# Altium schematic sheet CAN.SchDoc
size A4
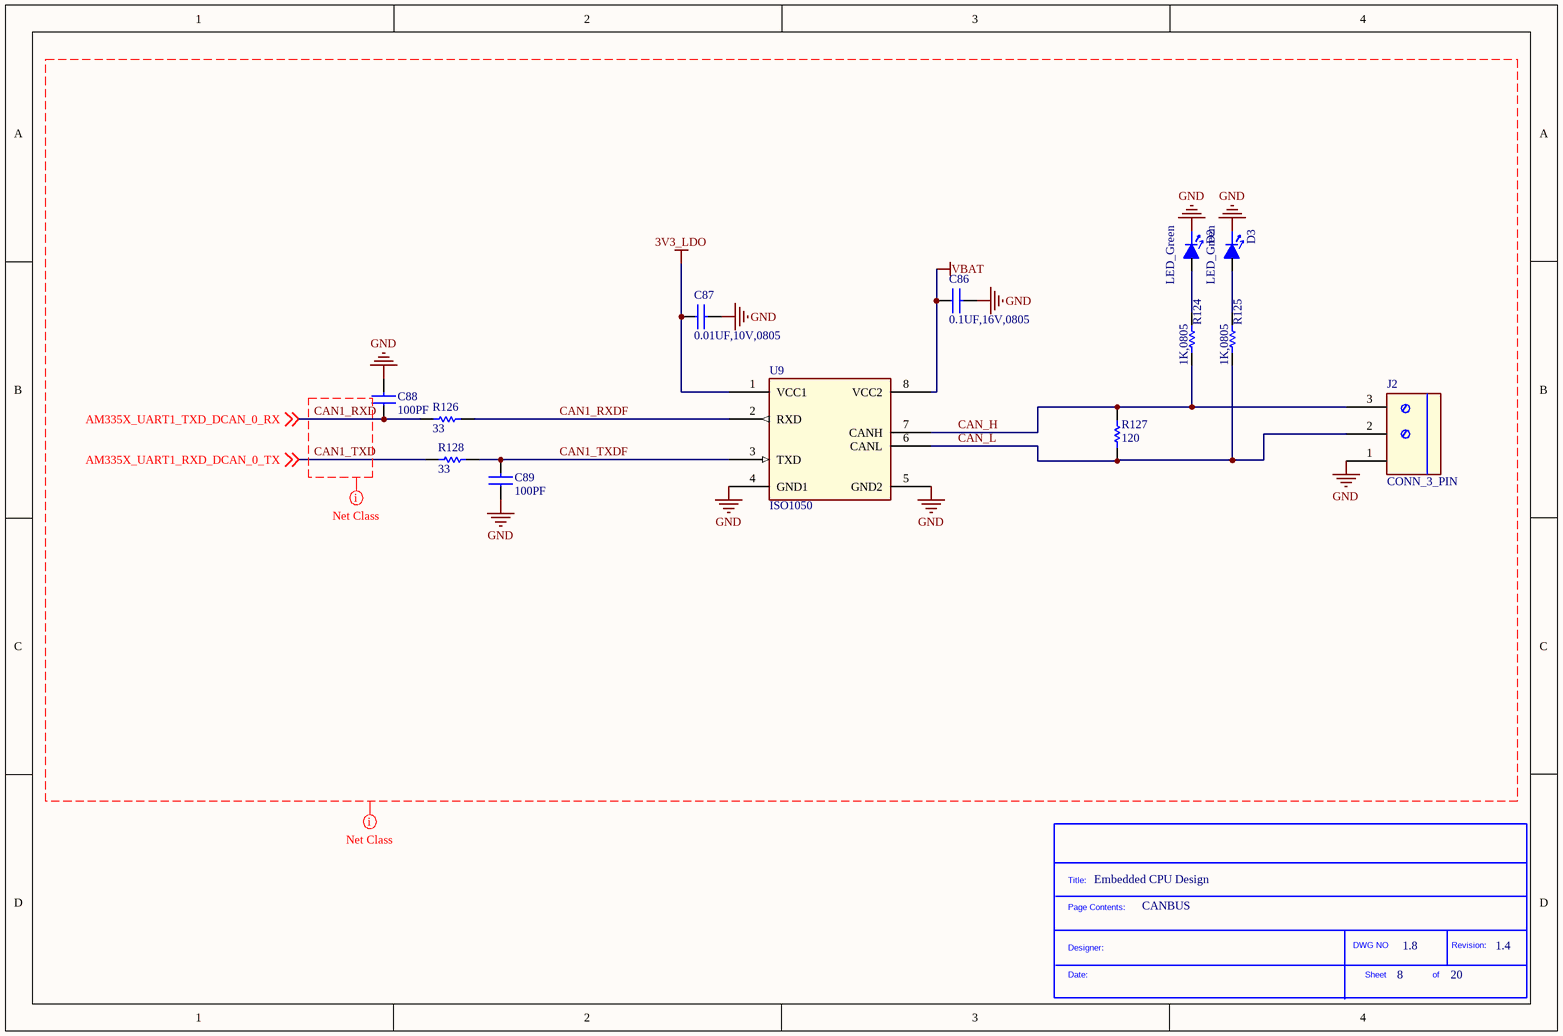
[diagram p0: CAN.SchDoc]

## Parts
*?  SDTitleBlock  (value not drawn)  (graphical)
C86  0.1UF,16V,0805  [0805]
C87  0.01UF,10V,0805  [0805]
C88  100PF  [0805]
C89  100PF  [0805]
D2  LED_Green  [LED_0805]
D3  LED_Green  [LED_0805]
J2  CONN_3_PIN  [CON_3]
R124  1K,0805  [0805]
R125  1K,0805  [0805]
R126  33  [0402]
R127  120  [0805]
R128  33  [0402]
U9  ISO1050  [so8_w_dub]

## Nets
3V3_LDO: C87.1 U9.1(VCC1)
GND: C86.2 C87.2 C88.2 C89.1 D2.1(Cathode) D3.1(Cathode) J2.1 U9.4(GND1) U9.5(GND2)
VBAT: C86.1 U9.8(VCC2)
CAN1_RXD: C88.1 R126.1 ; off-sheet AM335X_UART1_TXD_DCAN_0_RX  [also labelled AM335X_UART1_TXD_DCAN_0_RX]
CAN1_RXDF: R126.2 U9.2(RXD)
CAN1_TXD: R128.1 ; off-sheet AM335X_UART1_RXD_DCAN_0_TX  [also labelled AM335X_UART1_RXD_DCAN_0_TX]
CAN1_TXDF: C89.2 R128.2 U9.3(TXD)
CAN_H: J2.3 R124.1 R127.2 U9.7(CANH)
CAN_L: J2.2 R125.1 R127.1 U9.6(CANL)
NetD2_2: D2.2(Anode) R124.2
NetD3_2: D3.2(Anode) R125.2

## Layout directives
net class CAN: 3V3_LDO, AM335X_UART1_RXD_DCAN_0_TX, AM335X_UART1_TXD_DCAN_0_RX, CAN1_RXD, CAN1_RXDF, CAN1_TXD, CAN1_TXDF, CAN_H, CAN_L, GND, VBAT

## Notes on the sheet
- Embedded CPU Design
- CANBUS
- 8
- 1.8
- 20
- 1.4
- (in symbol SDTitleBlock) Title:; Page Contents:; DWG NO; Revision:; Designer:; Date:; Sheet; of

## Library data of the parts
C86 = 0.1UF,16V,0805: AVX - 0805YC104KAT2A - CAP, MLCC, X7R, 100NF, 16V, 0805; Capacitance: 0.1; Capacitance Tolerance: ± 10%; Dielectric Characteristic: X7; Voltage Rating: 16; Ceramic Capacitor Case: 0805 [2012 Metric]; SVHC: No SVHC (16-Jun-2014); Capacitor Case Style: 0805 [2012 Metric]<!--FANDB--><div class="features-and-benefits-container"></div>; Tolerance: ±10%; Supplier 1: Digi-Key; Manufacturer: AVX; Manufacturer Part Number: 0805YC104KAT2A; RoHS: YES; Stock 1: 9101; Pricing 1: 1=0.29, 10=0.198, 100=0.1008, 250=0.0816, 500=0.072, 1000=0.0612 (USD); Product Range: -; Operating Temperature Min: -55; Operating Temperature Max: 125; Packaging: Cut Tape; MSL: MSL 1 - Unlimited; Capacitance Tolerance ±: ± 10%; ComponentLink1URL: http://www.farnell.com/datasheets/1679506.pdf; ComponentLink1Description: http://www.farnell.com/datasheets/1679506.pdf; Supplier Part Number 1: 478-7961-1-ND; Category: Capacitors; Voltage - Rated: 16V; Temperature Coefficient: X7R; Mounting Type: Surface Mount, MLCC; Operating Temperature: -55°C ~ 125°C; Applications: General Purpose; Ratings: -; Package / Case: 0805 (2012 Metric); Size / Dimension: 0.079" L x 0.049" W (2.00mm x 1.25mm); Height - Seated (Max): -; Thickness (Max): 0.037" (0.94mm); Lead Spacing: -; Features: -; Lead Style: -; ComponentLink2URL: http://www.avx.com/docs/Catalogs/cx7r.pdf; ComponentLink2Description: http://www.avx.com/docs/Catalogs/cx7r.pdf
C87 = 0.01UF,10V,0805: MULTICOMP - MCSH21B103K100CT - CAP, MLCC, X7R, 10NF, 10V, 0805; Capacitance: 10000pF; Tolerance: ±10%; Voltage - Rated: 16V; Supplier 1: Digi-Key; Manufacturer: MULTICOMP; Manufacturer Part Number: MCSH21B103K100CT; RoHS: YES; Stock 1: 21284; Pricing 1: 1=0.24, 10=0.2, 50=0.1126, 100=0.1, 250=0.075, 500=0.06626, 1000=0.05875 (USD); ComponentLink1URL: http://www.farnell.com/datasheets/1825494.pdf; ComponentLink1Description: http://www.farnell.com/datasheets/1825494.pdf; Supplier Part Number 1: 399-7995-1-ND; Category: Capacitors; Packaging: Cut Tape (CT); Temperature Coefficient: X7R; Mounting Type: Surface Mount, MLCC; Operating Temperature: -55°C ~ 125°C; Applications: General Purpose; Ratings: -; Package / Case: 0805 (2012 Metric); Size / Dimension: 0.079" L x 0.049" W (2.00mm x 1.25mm); Height - Seated (Max): -; Thickness (Max): 0.035" (0.88mm); Lead Spacing: -; Features: -; Lead Style: -; ComponentLink2URL: http://www.kemet.com/docfinder?Partnumber=C0805C103K4RACTU; ComponentLink2Description: http://www.kemet.com/docfinder?Partnumber=C0805C103K4RACTU
C88 C89 = 100PF: MULTICOMP - MCMT21N101F100CT - CAP, MLCC, C0G/NP0, 100PF, 10V, 0805; Product Range: MULTICOMP - MCCA Series; Capacitance: 100; Capacitance Tolerance: ± 1%; Voltage Rating: 10; Ceramic Capacitor Case: 0805 [2012 Metric]; Capacitor Terminals: SMD; Temperature Coefficient: ± 30; Tolerance: ±10%; Voltage - Rated: 25V; Supplier 1: Digi-Key; Manufacturer: MULTICOMP; Manufacturer Part Number: MCMT21N101F100CT; RoHS: YES; Stock 1: 10259; Pricing 1: 1=0.16, 10=0.111, 50=0.063, 100=0.0522, 250=0.0432, 500=0.0366, 1000=0.0303 (USD); Dielectric Characteristic: C0G / NP0; Operating Temperature Min: -55; Operating Temperature Max: 125; Packaging: Cut Tape; MSL: -; Capacitance Tolerance ±: ± 1%; Capacitor Case Style: 0805 [2012 Metric]; Operating Temperature Range: -55°C to +125; Series: MT; ComponentLink1URL: http://www.farnell.com/datasheets/876497.pdf; ComponentLink1Description: http://www.farnell.com/datasheets/876497.pdf; ComponentLink2URL: http://www.farnell.com/datasheets/1825496.pdf; ComponentLink2Description: http://www.farnell.com/datasheets/1825496.pdf; Supplier Part Number 1: 399-9150-1-ND; Category: Capacitors; Mounting Type: Surface Mount, MLCC; Operating Temperature: -55°C ~ 125°C; Applications: General Purpose; Ratings: -; Package / Case: 0805 (2012 Metric); Size / Dimension: 0.079" L x 0.049" W (2.00mm x 1.25mm); Height - Seated (Max): -; Thickness (Max): 0.035" (0.88mm); Lead Spacing: -; Features: -; Lead Style: -; ComponentLink3URL: http://www.kemet.com/docfinder?Partnumber=C0805C101K3GACTU; ComponentLink3Description: http://www.kemet.com/docfinder?Partnumber=C0805C101K3GACTU
D2 D3 = LED_Green: LED Green SMD 20mA 2V 0805; TIIntPartnumber: 1F0008; MfrNum: 598-8170-107F; Mfr: Dialight; PartName: LEDGreen2x1.5; Cost10K: 0.052; Cost100: 0.081; Vendor: Digikey; Wavelength - Dominant: 566nm; Millicandela Rating: 20mcd; Viewing Angle: 140°; Lens Type: Clear; Lens Style/Size: Rectangle with Flat Top, 1.4mm x 1.25mm; DescriptiveText: LED Green SMD 20mA 2V 0805; Descriptive_Text: LED Green SMD 20mA 2V 0805; Supplier 1: Digi-Key; Manufacturer: Dialight; Manufacturer Part Number: 598-8170-107F; RoHS: RoHS Compliant; Category: Optoelectronics; Stock 1: 91030; Pricing 1: 1=0.42, 10=0.31, 25=0.248, 100=0.1643, 250=0.1364, 500=0.0992, 1000=0.0775 (USD); Packaging: Cut Tape (CT); Color: Green; Wavelength - Peak: -; Voltage - Forward (Vf) (Typ): 2V; Current - Test: 20mA; Package / Case: 0805 (2012 Metric); Size / Dimension: 2.00mm L x 1.25mm W; Height: 0.70mm; Mounting Type: Surface Mount; Luminous Flux @ Current - Test: -; ComponentLink1URL: http://media.digikey.com/pdf/Data%20Sheets/Dialight%20PDFs/598_Series_0805_Pkg.pdf; ComponentLink1Description: http://media.digikey.com/pdf/Data%20Sheets/Dialight%20PDFs/598_Series_0805_Pkg.pdf; Supplier Part Number 1: 350-2044-1-ND
R124 R125 = 1K,0805: BOURNS - CR0805-FX-1001ELF - RESISTOR, 1K, 0.125W, 1%; Product Range: BOURNS - CR Series; Resistance: 1; Power Rating: 125; Resistor Case Style: 0805 [2012 Metric]; Resistor Element Material: Thick Film; Temperature Coefficient: ± 100; Voltage Rating: 150; SVHC: No SVHC (16-Jun-2014); Resistor Mounting: SMD<!--FANDB--><div class="features-and-benefits-container"></div>; Power (Watts): 0.125W, 1/8W; Manufacturer: BOURNS; Manufacturer Part Number: CR0805-FX-1001ELF; RoHS: YES; Resistance Tolerance: ± 1%; Packaging: Cut Tape; MSL: MSL 1 - Unlimited; ComponentLink1URL: http://www.farnell.com/datasheets/1845293.pdf; ComponentLink1Description: http://www.farnell.com/datasheets/1845293.pdf; Supplier 1: Digi-Key; Category: Resistors; Stock 1: 2060902; Pricing 1: 1=0.1, 50=0.0288, 100=0.0219, 250=0.01624, 500=0.012, 1000=0.008, 2500=0.00675 (USD); Resistance (Ohms): 1k; Tolerance: ±1%; Composition: Thick Film; Features: Automotive AEC-Q200; Operating Temperature: -55°C ~ 155°C; Package / Case: 0805 (2012 Metric); Supplier Device Package: 0805; Size / Dimension: 0.079" L x 0.049" W (2.00mm x 1.25mm); Height: 0.028" (0.70mm); Number of Terminations: 2; ComponentLink2URL: http://industrial.panasonic.com/www-cgi/jvcr13pz.cgi?E+PZ+3+AOA0002+ERJ6ENF1001V+7+WW; ComponentLink2Description: http://industrial.panasonic.com/www-cgi/jvcr13pz.cgi?E+PZ+3+AOA0002+ERJ6ENF1001V+7+WW; Supplier Part Number 1: P1.00KCCT-ND
R126 R128 = 33: MULTICOMP - MC0805S8F330JT5E - RESISTOR, THICK FILM, 33 OHM, 125mW, 1%; Power (Watts): 0.1W, 1/10W; Temperature Coefficient: ±100ppm/°C; Supplier 1: Digi-Key; Manufacturer: MULTICOMP; Manufacturer Part Number: MC0805S8F330JT5E; RoHS: YES; Stock 1: 1096583; Pricing 1: 1=0.1, 50=0.0196, 100=0.0149, 250=0.01104, 500=0.00816, 1000=0.00544, 5000=0.00383 (USD); ComponentLink1URL: http://www.newark.com/pdfs/datasheets/spc/TA-677.pdf; ComponentLink1Description: http://www.newark.com/pdfs/datasheets/spc/TA-677.pdf; Supplier Part Number 1: P33.0LCT-ND; Category: Resistors; Packaging: Cut Tape (CT); Resistance (Ohms): 33; Tolerance: ±1%; Composition: Thick Film; Features: Automotive AEC-Q200; Operating Temperature: -55°C ~ 155°C; Package / Case: 0402 (1005 Metric); Supplier Device Package: 0402; Size / Dimension: 0.039" L x 0.020" W (1.00mm x 0.50mm); Height: 0.016" (0.40mm); Number of Terminations: 2; ComponentLink2URL: http://industrial.panasonic.com/www-cgi/jvcr13pz.cgi?E+PZ+3+AOA0002+ERJ2RKF33R0X+7+WW; ComponentLink2Description: http://industrial.panasonic.com/www-cgi/jvcr13pz.cgi?E+PZ+3+AOA0002+ERJ2RKF33R0X+7+WW
R127 = 120: BOURNS - CR0805-FX-1200GLF - RESISTOR, 0805, 120R, 1%, 1/8W; Tolerance: ±5%; Power (Watts): 0.125W, 1/8W; Temperature Coefficient: ±200ppm/°C; Supplier 1: Digi-Key; Manufacturer: BOURNS; Manufacturer Part Number: CR0805-FX-1200GLF; RoHS: YES; Stock 1: 49631; Pricing 1: 1=0.1, 10=0.021, 50=0.0116, 100=0.0088, 250=0.00652, 500=0.0048, 1000=0.0032, 2500=0.0027 (USD); ComponentLink1URL: http://www.farnell.com/datasheets/1845293.pdf; ComponentLink1Description: http://www.farnell.com/datasheets/1845293.pdf; Supplier Part Number 1: RMCF0805JT120RCT-ND; Category: Resistors; Packaging: Cut Tape (CT); Resistance (Ohms): 120; Composition: Thick Film; Features: -; Operating Temperature: -55°C ~ 155°C; Package / Case: 0805 (2012 Metric); Supplier Device Package: 0805; Size / Dimension: 0.079" L x 0.049" W (2.00mm x 1.25mm); Height: 0.026" (0.65mm); Number of Terminations: 2; ComponentLink2URL: http://www.seielect.com/Catalog/SEI-RMCF_RMCP.pdf; ComponentLink2Description: http://www.seielect.com/Catalog/SEI-RMCF_RMCP.pdf
U9 = ISO1050: Isolated CAN Transceiver; TIIntPartnumber: 1A0214; MfrNum: ISO1050DUB; Mfr: TI; Manufacturer: Texas Instruments; Cost10K: 1.91; Cost100: 3.41; Vendor: Digikey; Number of Drivers/Receivers: 1/1; Duplex: Half; Receiver Hysteresis: 150mV; Data Rate: 1Mbps; Voltage - Supply: 3 V ~ 5.5 V; Descriptive_Text: Isolated CAN Transceiver; PartName: ISO1050; DescriptiveText: Isolated CAN Transceiver; Supplier 1: Digi-Key; Supplier Part Number 1: 296-33295-5-ND; Manufacturer Part Number: ISO1050DUB; RoHS: RoHS Compliant; Category: Integrated Circuits (ICs); Stock 1: 3315; Pricing 1: 1=5.8, 10=5.175, 25=4.6576, 100=4.2435, 250=3.82952, 500=3.4362, 750=3.105, 1000=2.5875 (USD); Packaging: Tube; Type: Transceiver; Protocol: CAN; Operating Temperature: -55°C ~ 105°C; Mounting Type: Surface Mount; Package / Case: 8-SMD, Gull Wing; Supplier Device Package: 8-SOP; ComponentLink1URL: http://www.ti.com/lit/ds/symlink/iso1050.pdf; ComponentLink1Description: http://www.ti.com/lit/ds/symlink/iso1050.pdf